# EAGLE schematic laserdriver_v3_2 (EAGLE 7.5.0)
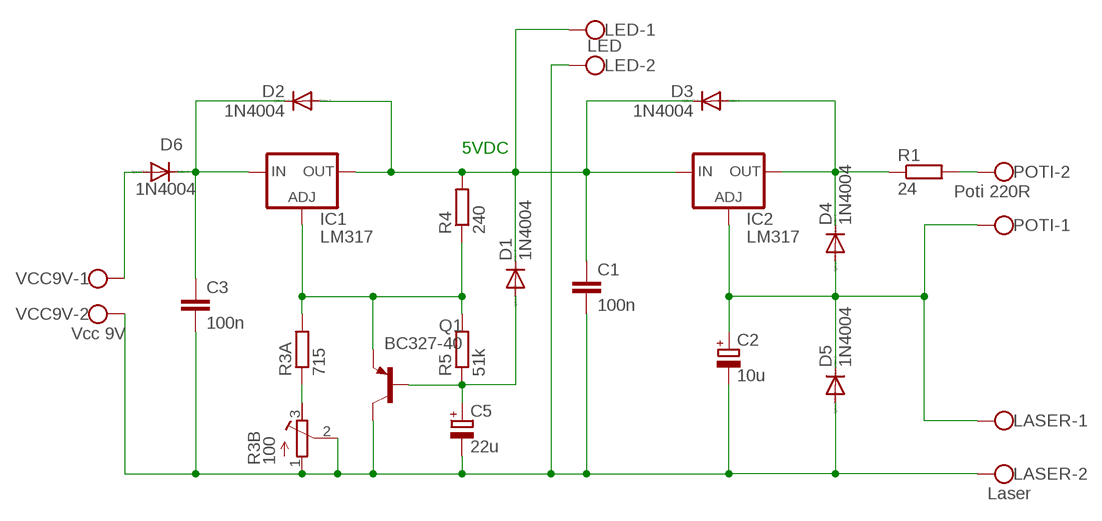
[diagram p0: schematic, sheet 1]

## Parts
C1  100n  C-EU050-024X044  [C050-024X044]
C2  10u  CPOL-EUE2-5  [E2-5]
C3  100n  C-EU050-024X044  [C050-024X044]
C5  22u  CPOL-EUE2-5  [E2-5]
D1  1N4004  [DO41-10]
D2  1N4004  [DO41-10]
D3  1N4004  [DO41-10]
D4  1N4004  [DO41-10]
D5  1N4004  [DO41-10]
D6  1N4004  [DO41-10]
IC1  LM317  LM317TS  [317TS]
IC2  LM317  LM317TS  [317TS]
LASER  Laser  W237-102  [W237-102]
LED  LED  W237-102  [W237-102]
POTI  Poti 220R  W237-102  [W237-102]
Q1  BC327-40  [TO92-EBC]
R1  24  R-EU_0207/7  [0207/7]
R3A  715  R-EU_0207/7  [0207/7]
R3B  100  R-TRIMM3296W  [RTRIM3296W]
R4  240  R-EU_0207/7  [0207/7]
R5  51k  R-EU_0207/7  [0207/7]
VCC9V  Vcc 9V  W237-102  [W237-102]

## Nets
N$1: C1.1 D1.C D2.A D3.C IC1.2(OUT) IC2.3(IN) LED.1 R4.2
N$2: C2.+ D4.A D5.C IC2.1(ADJ) LASER.1 POTI.1
N$3: D3.A D4.C IC2.2(OUT) R1.1
N$4: POTI.2 R1.2
N$5: C5.+ D1.A Q1.B R5.1
N$6: D6.A VCC9V.1
N$7: C3.1 D2.C D6.C IC1.3(IN)
N$8: R3A.1 R3B.3(E)
N$9: C1.2 C2.- C3.2 C5.- D5.A LASER.2 LED.2 Q1.C R3B.1(A) R3B.2(S) VCC9V.2
N$12: IC1.1(ADJ) Q1.E R3A.2 R4.1 R5.2

## Notes on the sheet
- 5VDC

## Library data of the parts
C1 C3 = rcl:C-EU: CAPACITOR, European symbol
C2 C5 = rcl:CPOL-EU: POLARIZED CAPACITOR, European symbol
D1-D6 = diode:1N4004: DIODE general purpose rectifier, 1 A
IC1 IC2 = v-reg:LM317TS: VOLTAGE REGULATOR
LASER LED POTI VCC9V = con-wago-500:W237-102: WAGO SCREW CLAMP; MPN: 237-102; OC_FARNELL: unknown; OC_NEWARK: 70K9898
Q1 = transistor-pnp:BC327*: PNP Transistror
R1 R3A R4 R5 = rcl:R-EU_: RESISTOR, European symbol
R3B = rcl:R-TRIMM: Trimm resistor